# Altium schematic sheet PowerSupply_404_JustBuck.SchDoc
size C; SheetNumber: 1; SheetTotal: 1; SPICEModelCacheLMAETMOC: <root> / <DocumentId>LMAETMOC</DocumentId> / </root>
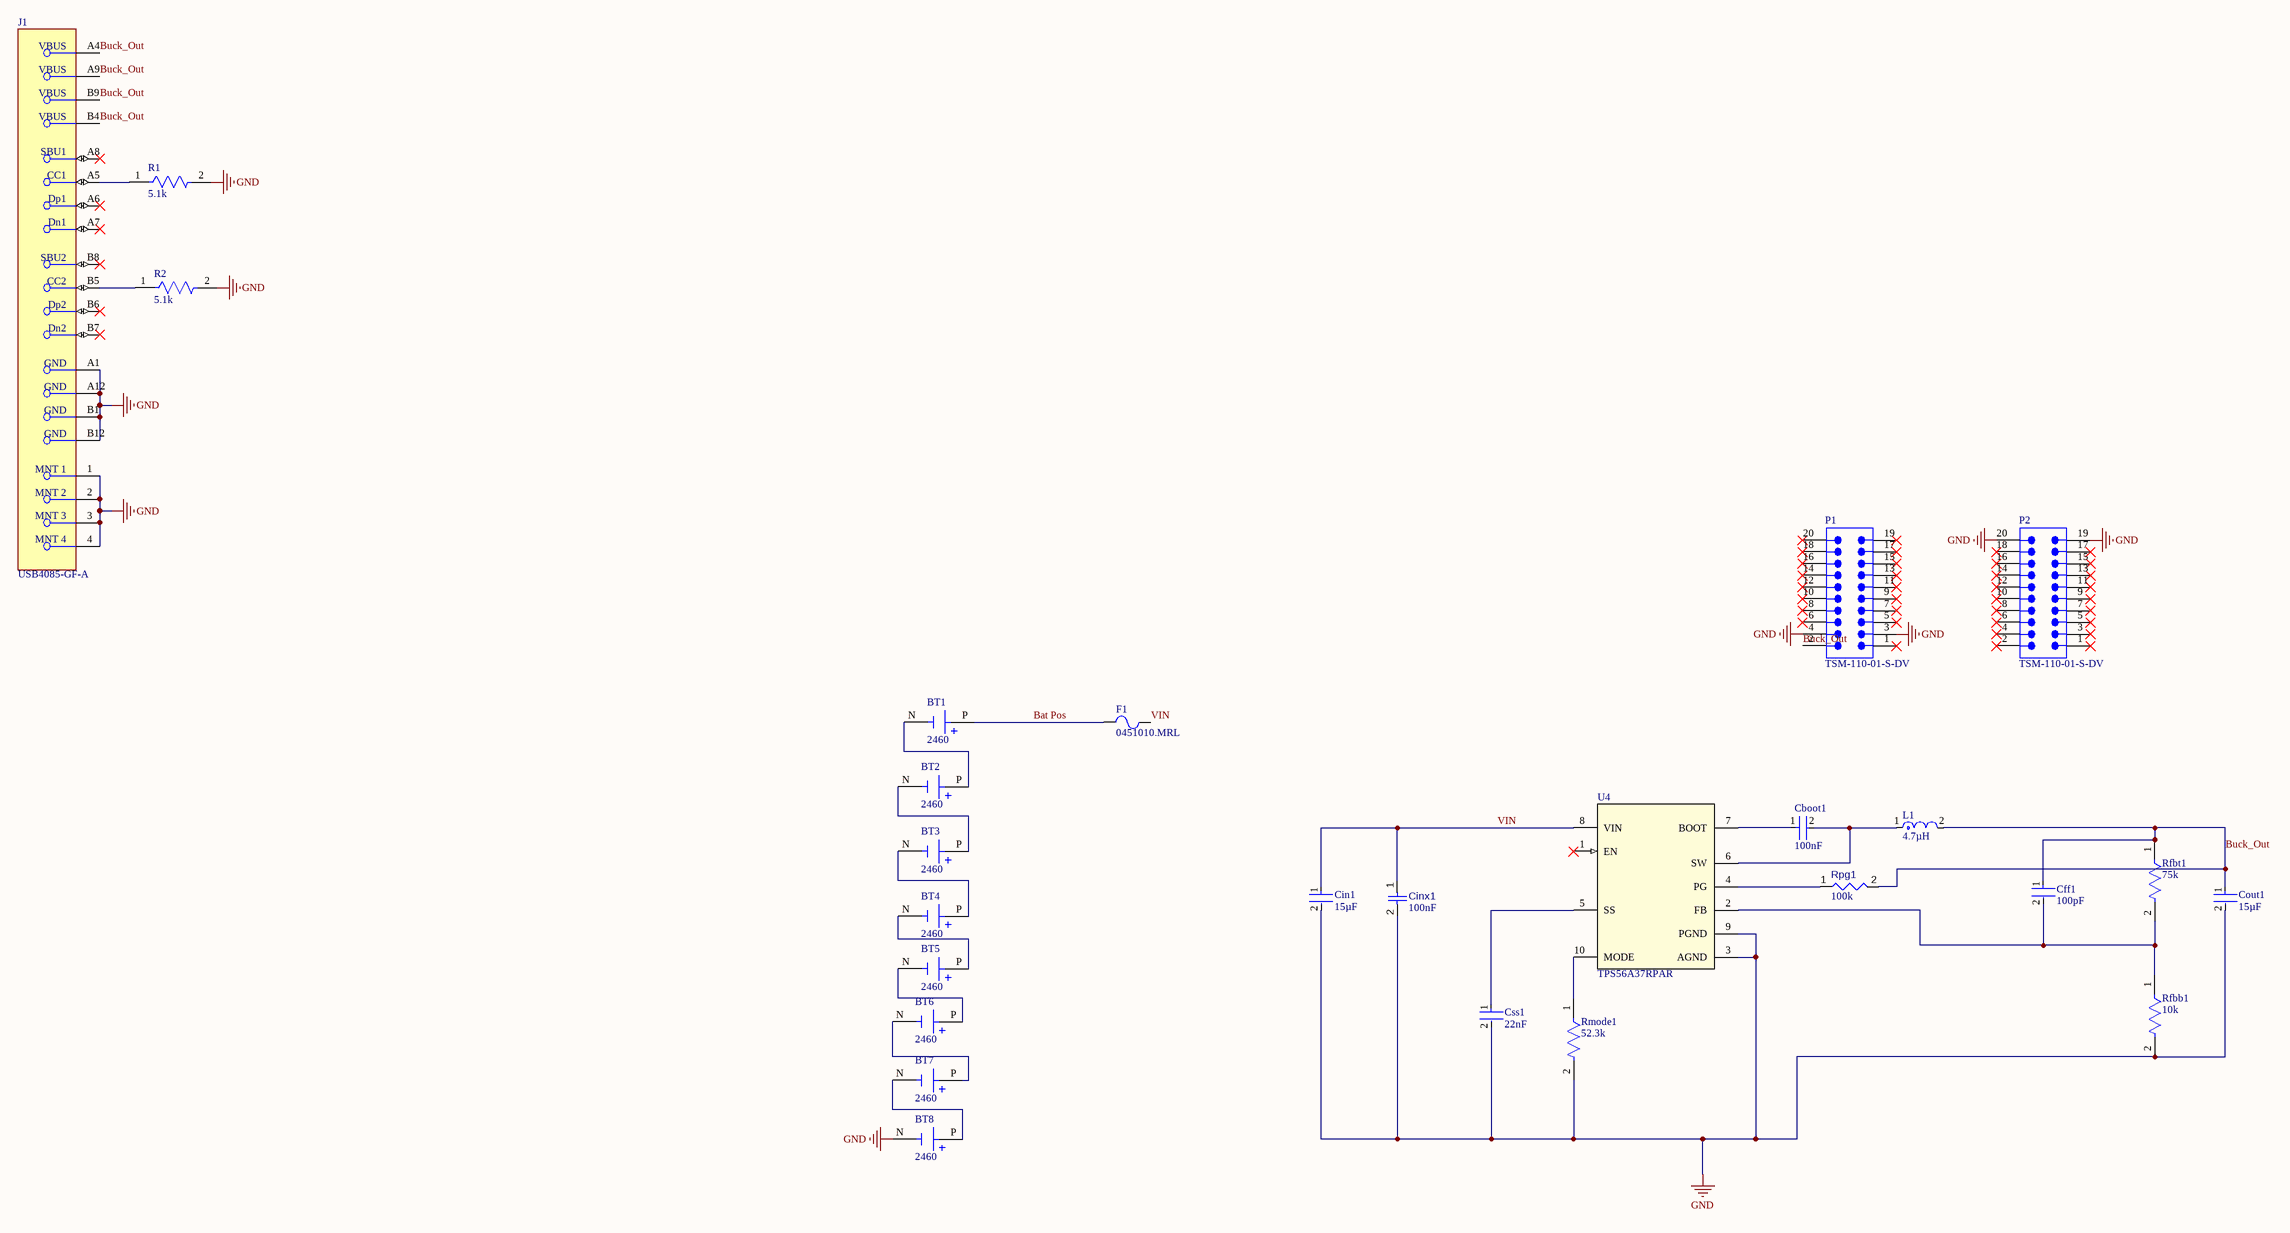
[diagram p0: PowerSupply_404_JustBuck.SchDoc]

## Parts
BT1  2460  [BAT_2460]
BT2  2460  [BAT_2460]
BT3  2460  [BAT_2460]
BT4  2460  [BAT_2460]
BT5  2460  [BAT_2460]
BT6  2460  [BAT_2460]
BT7  2460  [BAT_2460]
BT8  2460  [BAT_2460]
Cboot1  value 100nF  [FP-C0805C-DN-IPC_A]  (hidden comment: C0805C104M5RACTU)
Cff1  value 100pF  [FP-C0805C-DN-IPC_A]  (hidden comment: C0805C101K5GACTU)
Cin1  value 15µF  [FP-C2012-125-0_2-IPC_A]  (hidden comment: C2012X5R1V156M125AC)
Cinx1  value 100nF  [CAPC2013X95X50LL10T25]  (hidden comment: CC0805KRX7R9BB104)
Cout1  value 15µF  [FP-C3225-250-0_4-IPC_A]  (hidden comment: C3225X5R1C156M250AA)
Css1  value 22nF  [FP-C0603C-CF-IPC_B]  (hidden comment: C0603C223K4RACTU)
F1  0451010.MRL  [LFUS-45X_V]
J1  USB4085-GF-A  [FP-USB4085-GF-A-MFG]
L1  value 4.7µH  [FP-XAL6060-472MEC-MFG]  (hidden comment: XAL6060-472MEC)
P1  TSM-110-01-S-DV  [SMTC-TSM-110-01-X-DV]
P2  TSM-110-01-S-DV  [SMTC-TSM-110-01-X-DV]
R1  value 5.1k  [FP-RT0603-IPC_C]  (hidden comment: RT0603FRE075K1L)
R2  value 5.1k  [FP-RT0603-IPC_C]  (hidden comment: RT0603FRE075K1L)
Rfbb1  value 10k  [FP-CRCW0805-e3-IPC_A]  (hidden comment: CRCW080510K0FKEA)
Rfbt1  value 75k  [FP-CRCW0805-e3-IPC_A]  (hidden comment: CRCW080575K0FKEA)
Rmode1  value 52.3k  [FP-CRCW0603-e3-IPC_C]  (hidden comment: CRCW060352K3FKEA)
Rpg1  value 100k  [RESC2013X70X40ML20T20]  (hidden comment: ERJ-6ENF1003V)
U4  TPS56A37RPAR  [RPA0010A-MFG]

## Nets
GND: BT8.N(NEG) Cin1.2 Cinx1.2 Cout1.2 Css1.2 J1.1(MNT_1) J1.2(MNT_2) J1.3(MNT_3) J1.4(MNT_4) J1.A1(GND) J1.A12(GND) J1.B1(GND) J1.B12(GND) P1.3 P1.4 P2.19 P2.20 R1.2 R2.2 Rfbb1.2 Rmode1.2 U4.3(AGND) U4.9(PGND)
Bat Pos: BT1.P(POS) F1.1
Buck_Out: Cff1.1 Cout1.1 J1.A4(VBUS) J1.A9(VBUS) J1.B4(VBUS) J1.B9(VBUS) L1.2 P1.2 Rfbt1.1 Rpg1.2
VIN: Cin1.1 Cinx1.1 F1.2 U4.8(VIN)
NetBT1_N: BT1.N(NEG) BT2.P(POS)
NetBT2_N: BT2.N(NEG) BT3.P(POS)
NetBT3_N: BT3.N(NEG) BT4.P(POS)
NetBT4_N: BT4.N(NEG) BT5.P(POS)
NetBT5_N: BT5.N(NEG) BT6.P(POS)
NetBT6_N: BT6.N(NEG) BT7.P(POS)
NetBT7_N: BT7.N(NEG) BT8.P(POS)
NetCboot1_1: Cboot1.1 U4.7(BOOT)
NetCboot1_2: Cboot1.2 L1.1 U4.6(SW)
NetCff1_2: Cff1.2 Rfbb1.1 Rfbt1.2 U4.2(FB)
NetCss1_1: Css1.1 U4.5(SS)
NetJ1_A5: J1.A5(CC1) R1.1
NetJ1_B5: J1.B5(CC2) R2.1
NetRmode1_1: Rmode1.1 U4.10(MODE)
NetRpg1_1: Rpg1.1 U4.4(PG)

Not connected (* = marked no-connect by the designer): J1 A6(Dp1)* A7(Dn1)* A8(SBU1)* B6(Dp2)* B7(Dn2)* B8(SBU2)*; P1 1* 5* 6* 7* 8* 9* 10* 11* 12* 13* 14* 15* 16* 17* 18* 19* 20*; P2 1* 2* 3* 4* 5* 6* 7* 8* 9* 10* 11* 12* 13* 14* 15* 16* 17* 18*; U4 1(EN)*

## Library data of the parts
BT1-BT8 = CMP-00029-00003-2: Battery Holder, AA, Polypropylene, PC Mount, 1, Spring, PC Lug; MF: Keystone Electronics; Value: *; SnapEDA_Link: https://www.snapeda.com/parts/2460/Keystone/view-part/?ref=snap; Case/Package: None; MP: 2460; Check_prices: https://www.snapeda.com/parts/2460/Keystone/view-part/?ref=eda; Design Item ID: 2460; Component Type: Standard; Source: 2460.SchLib; Pins: 2
Cboot1 = CMP-001-00110-1: 50V 100nF X7R ±20% 0805 Multilayer Ceramic Capacitors MLCC - SMD/SMT ROHS; Dissipation Factor: 2.5%; Temperature Coefficient: 30ppm/°C; Case Code (Imperial): 0805; Introduction Date: 2008-01-10; Depth: 1.25mm; Number of Terminals: 2; Voltage: 50V; Harmonized Tariff Schedule (HTS) Code: 8532.24.00.20; Width: 1.25mm; Export Control Classification Number (ECCN) Code: EAR99; China RoHS: Compliant; Thickness: 889µm; Tolerance: 20%; Schedule B: 8532240020, 8532240020; Voltage Rating: 50V; RoHS: Compliant; Termination: SMD/SMT; Country of Origin: Mexico; Lifecycle Status: Production; Lead Free: Lead Free; Packaging: Cut Tape; Weight: 5.499807mg; Max Operating Temperature: 125°C; Pins: 2; Case/Package: 0805; Height: 780µm; Voltage Rating (DC): 50V; Length: 2mm; Min Operating Temperature: -55°C; REACH SVHC: Yes; Dielectric: X7R; Dielectric Material: Ceramic; Material: Ceramic; Mounting Technology: Surface Mount; Radiation Hardening: No
Cff1 = CMP-001-00093-1: 50V 100pF C0G ±10% 0805 Multilayer Ceramic Capacitors MLCC - SMD/SMT ROHS; Temperature Coefficient: 30ppm/°C; Dissipation Factor: 0.1%; RoHS: Compliant; Dielectric Material: Ceramic; Material: Ceramic; Depth: 1.25mm; Lead Pitch: 750µm; Mounting Technology: Surface Mount; Voltage Rating (DC): 50V; Voltage Rating: 50V; Lead Free: Lead Free; Termination: SMD/SMT; Number of Terminals: 2; Lifecycle Status: Production; Width: 1.25mm; Case Code (Imperial): 0805; Length: 2mm; Export Control Classification Number (ECCN) Code: EAR99; Tolerance: 10%; Country of Origin: Mexico; Radiation Hardening: No; REACH SVHC: Yes; Min Operating Temperature: -55°C; Max Operating Temperature: 125°C; Harmonized Tariff Schedule (HTS) Code: 8532.24.00.20; China RoHS: Compliant; Pins: 2; Packaging: Cut Tape; Case/Package: 0805; Height: 780µm; Introduction Date: 2008-01-10; Schedule B: 8532240020, 8532240020; Thickness: 889µm; Voltage: 50V; Dielectric: C0G; Contact Plating: Tin
Cin1 = CMP-001-00107-1: 35V 15uF X5R 卤20% 0805 Multilayer Ceramic Capacitors MLCC - SMD/SMT ROHS; Manufacturer Lifecycle Status: PRODUCTION; Tolerance: 20%; Voltage Rating: 35V; Dielectric Material: Ceramic; Width: 1.25mm; Case Code (Metric): 2012; Export Control Classification Number (ECCN) Code: EAR99; Max Operating Temperature: 85°C; Schedule B: 8532240020, 8532240020; Lifecycle Status: Production; Case Code (Imperial): 0805; Introduction Date: 2013-02-27; Dielectric: X5R; REACH SVHC: Yes; Material: Ceramic; Composition: Ceramic; Packaging: Digi-Reel®; Termination: SMD/SMT; Min Length: 1.8mm; Number of Terminals: 2; Harmonized Tariff Schedule (HTS) Code: 8532.24.00.20; Min Operating Temperature: -55°C; Min Width: 1.05mm; Lead Free: Lead Free; China RoHS: Compliant; RoHS: Compliant; Length: 2mm; Max Width: 1.45mm; Case/Package: 0805; Mounting Technology: Surface Mount; Voltage Rating (DC): 35V; Height: 1.25mm; Max Length: 2.2mm
Cinx1 = CMP-001-00018-6: Chip Capacitor, 100 nF, +/- 10%, 50 V, 0805 (2012 Metric); Capacitor Type: Ceramic; Voltage Rating: 50V; Pins: 2; Max Operating Temperature: 125°C; Min Operating Temperature: -55°C; Mounting Technology: SM; Case/Package: 0805; RoHS Compliant: True; Tolerance: 10%
Cout1 = CMP-001-00109-1: 16V 15uF X5R 卤20% 1210 Multilayer Ceramic Capacitors MLCC - SMD/SMT ROHS; Manufacturer Lifecycle Status: PRODUCTION (NOT RECOMMENDED FOR NEW DESIGN); Tolerance: 20%; Schedule B: 8532240020, 8532240020; Termination: SMD/SMT; Width: 2.5mm; Dielectric Material: Ceramic; Max Operating Temperature: 85°C; Harmonized Tariff Schedule (HTS) Code: 8532.24.00.20; Export Control Classification Number (ECCN) Code: EAR99; Case Code (Imperial): 1210; Length: 3.2mm; Lead Free: Lead Free; Packaging: Digi-Reel®; REACH SVHC: Yes; Min Operating Temperature: -55°C; China RoHS: Compliant; Min Width: 2.2mm; Min Length: 2.8mm; Case/Package: 1210; Mounting Technology: Surface Mount; Max Width: 2.8mm; Case Code (Metric): 3225; Number of Terminals: 2; Dielectric: X5R; RoHS: Compliant; Voltage Rating: 16V; Material: Ceramic; Introduction Date: 2012-08-21; Lifecycle Status: NRND; Height: 2.5mm; Voltage Rating (DC): 16V; Composition: Ceramic; Depth: 2.5mm; Max Length: 3.6mm; Weight: 15.989131mg
Css1 = CMP-001-00108-1: Multilayer Ceramic Capacitors MLCC - SMD/SMT 16V 0.022uF X7R 0603 10%; Temperature Coefficient: 30ppm/°C; Export Control Classification Number (ECCN) Code: EAR99; Min Operating Temperature: -55°C; Termination: SMD/SMT; China RoHS: Compliant; Voltage Rating (DC): 16V; Number of Terminals: 2; Introduction Date: 2001-04-27; REACH SVHC: Yes; Material: Ceramic; RoHS: Compliant; Voltage Rating: 16V; Radiation Hardening: No; Weight: 2.012816mg; Width: 800µm; Thickness: 863.6µm; Depth: 800µm; Pins: 2; Case Code (Imperial): 0603; Dielectric Material: Ceramic; Harmonized Tariff Schedule (HTS) Code: 8532.24.00.20; Case/Package: 0603; Lifecycle Status: Production; Dielectric: X7R; Tolerance: 10%; Height: 800µm; Country of Origin: Mexico; Length: 1.6mm; Schedule B: 8532240020, 8532240020; Mounting Technology: Surface Mount; Lead Free: Lead Free; Max Operating Temperature: 125°C
F1 = CMP-005-00013-1: Fuse Chip Very Fast Acting 10A 125V SMD Solder Pad 2410 Ceramic T/R CSA/PSE/UL; Time to Trip: 5s; Value: 5.6mΩ; Approvals: CSA, PSE, UL; Height: 2.69mm; Working Voltage: 125V; Lead Free: Lead Free; RoHS: Compliant; Mounting Technology: Surface Mount; Voltage Rating (DC): 125V; Depth: 2.69mm; Case/Package: SMD/SMT; Length: 6.1mm; Export Control Classification Number (ECCN) Code: EAR99; Country of Origin: Philippines; Fuse Current: 10A; Min Operating Temperature: -55°C; Pins: 2; Contact Plating: Gold; Current Rating: 10A; Diameter: 2.69mm; Width: 2.69mm; Lifecycle Status: Production; Voltage Rating: 125V; Termination: SMD/SMT; REACH SVHC: No; China RoHS: Non-Compliant; Radiation Hardening: No; Introduction Date: 2008-03-05; Terminal Material: Gold; Housing Material: Ceramic; Harmonized Tariff Schedule (HTS) Code: 8536.10.00.40; Max Operating Temperature: 125°C; Body Material: Ceramic; Voltage Rating (AC): 125V
J1 = CMP-002-00075-1: USB Connector, 16 Contact(s), Female, Right Angle, Solder Terminal, Locking, Receptacle; Voltage Rating: 20V; Insulation Resistance: 100MΩ; USB Standard: USB 2.0; Row Spacing: 1.35mm; Contact Resistance: 50mΩ; Dielectric Material: Liquid Crystal Polymer; Number of Ports: 1; Operating Force: 20N; Current Rating: 250mA; Number of Contacts: 16; Pins: 16; Country of Origin: Mainland China; Terminal Pitch: 850µm; Contact Gender: Female; REACH SVHC: Yes; Contact Material: Gold, Nickel; Height: 3.66mm; Introduction Date: 2018-08-17; China RoHS: Compliant; Shell Finish: Nickel; Max Operating Temperature: 85°C; Harmonized Tariff Schedule (HTS) Code: 8536.69.40.30; Shell Material: Stainless Steel; Lifecycle Status: Production; Number of Rows: 2; RoHS: Compliant; Gender: Receptacle; Export Control Classification Number (ECCN) Code: EAR99; Min Operating Temperature: -40°C
L1 = CMP-006-00027-1: XAL6060-472MEC; General Purpose Inductor, 4.7uH, 20%, 1 Element, Composite-Core, SMD, 2625; Max Current Rating: 11A; Self Resonant Frequency: 21MHz; Test Frequency: 1MHz; Number of Circuits: 1; DC Resistance (DCR): 14.4mΩ; Saturation Current: 10.5A; Shielding: Shielded; REACH SVHC: Yes; Inductance Tolerance: 20%; Termination: SMD/SMT; Packaging: Cut Tape; RoHS: Compliant; Lifecycle Status: Production; Height: 6.1mm; Mounting Technology: Surface Mount; Number of Terminals: 2; Ambient Temperature Range High: 125°C; Lead Free: Contains Lead; Core Material: Composite; RMS Current (Irms): 11A; Max DC Current: 11A; Length: 6.76mm; Tolerance: 20%; ESR: 14.4mΩ; Max Operating Temperature: 125°C; Min Operating Temperature: -40°C; Case/Package: SMD/SMT; Width: 6.36mm
P1 P2 = CMP-002-00074-1: 0.025" SQ Post Header, Surface Mount, Vertical, -55 to 125 degC, 2.54 mm Pitch, 20-Pin, Male, RoHS; Manufacturer: Samtec; Pitch: 2.54 mm; Component Type: Standard; PartNumber: TSM-110-01-S-DV; PackageReference: TSM-110-01-X-DV; DatasheetVersion: F-214; ComponentLink1Description: Manufacturer URL; ComponentLink3URL: http://www.samtec.com/documents/webfiles/cpdf/TSM-1XX-XX-XXX-XX-X-XXX-X-MKT.pdf; Source: TSM_110_01_S_DV.SchLib; ComponentLink1URL: http://www.samtec.com; Design Item ID: CMP-1024-00283-1; ComponentLink2Description: Datasheet; PackageVersion: DJ, 4/1991; Mounting Technology: Surface Mount; Orientation: Vertical; Pins: 20; Temperature Range: -55 to 125 degC; ComponentLink3Description: Package Specification; ComponentLink2URL: http://www.samtec.com/documents/webfiles/pdf/TSM.PDF; Case/Package: Double Row Gullwing ASM; RoHS: True
R1 R2 = CMP-009-00180-1: Fixed Resistor, Thin Film, 0.1W, 5100ohm, 75V, 1% +/-Tol, 50ppm/Cel, Surface Mount, 0603; Power Dissipation: 100mW; Voltage Rating (DC): 50V; Temperature Coefficient: 50ppm/°C; Voltage Rating: 75V; Number of Terminals: 2; Lead Free: Lead Free; Width: 800µm; Working Voltage: 75V; Lifecycle Status: Production; Height: 450µm; RoHS: Compliant; Power Rating: 100mW; Mounting Technology: Surface Mount; Length: 1.6mm; China RoHS: Non-Compliant; Max Power Dissipation: 100mW; Number of Terminations: 2; Termination: SMD/SMT; Case/Package: 0603; REACH SVHC: Yes; Max Operating Temperature: 155°C; Tolerance: 1%; Military Standard: Not; Min Operating Temperature: -55°C; Composition: Thin Film; Depth: 800µm; Case Code (Imperial): 0603
Rfbb1 = CMP-009-00183-1: Res Thick Film 0805 10K Ohm 1% 0.125W(1/8W) ±100ppm/C Pad SMD Automotive T/R; Manufacturer Package Identifier: CRCW0805-e3; Temperature Coefficient: 100ppm/°C; Voltage Rating: 150V; Power Dissipation: 125mW; Power Rating: 120mW; Country of Origin: Israel; Weight: 5.499807mg; Radiation Hardening: No; Height: 450µm; Length: 2mm; Tolerance: 1%; Width: 1.25mm; Harmonized Tariff Schedule (HTS) Code: 8533.21.00.30; Working Voltage: 150V; Packaging: Cut Tape; Military Standard: Not; Max Operating Temperature: 155°C; Min Operating Temperature: -55°C; Lifecycle Status: Production; Case/Package: 0805; Depth: 1.25mm; Contact Plating: Tin; Export Control Classification Number (ECCN) Code: EAR99; Lead Free: Lead Free; Schedule B: 8533210045, 8533210045; Composition: Thick Film; RoHS: Compliant; Mounting Technology: Surface Mount; Voltage Rating (DC): 150V; Number of Terminals: 2; Introduction Date: 2005-02-16; Pins: 2; Termination: SMD/SMT; Case Code (Imperial): 0805; REACH SVHC: Yes; China RoHS: Non-Compliant
Rfbt1 = CMP-009-00196-1: Res Thick Film 0805 75K Ohm 1% 1/8W ±100ppm/°C Molded SMD Paper T/R; Manufacturer Package Identifier: CRCW0805-e3; Working Voltage: 150V; Power Dissipation: 125mW; Number of Terminals: 2; Weight: 5.499807mg; Temperature Coefficient: 100ppm/°C; Schedule B: 8533210045, 8533210045; Min Operating Temperature: -55°C; Pins: 2; Mounting Technology: Surface Mount; Termination: SMD/SMT; Voltage Rating: 150V; China RoHS: Non-Compliant; Max Operating Temperature: 155°C; Voltage Rating (DC): 150V; Number of Terminations: 2; Width: 1.25mm; Height: 450µm; Depth: 1.25mm; Max Power Dissipation: 125mW; Radiation Hardening: No; Introduction Date: 2005-02-16; Case Code (Imperial): 0805; Features: Automotive AEC-Q200; Harmonized Tariff Schedule (HTS) Code: 8533.21.00.30; Length: 2mm; Country of Origin: Israel; Contact Plating: Tin; Lifecycle Status: Production; Composition: Thick Film; Export Control Classification Number (ECCN) Code: EAR99; Military Standard: Not; REACH SVHC: Yes; RoHS: Compliant; Lead Free: Lead Free; Case/Package: 0805; Power Rating: 125mW; Packaging: Cut Tape; Tolerance: 1%
Rmode1 = CMP-009-00197-1: 100mW Thick Film Resistors 75V ±1% ±100ppm/℃ 52.3kΩ 0603 Chip Resistor - Surface Mount ROHS; Temperature Coefficient: 100ppm/°C; Country of Origin: Israel, Taiwan; Width: 850µm; Schedule B: 8533210045, 8533210045; Power Dissipation: 100mW; Power Rating: 100mW; Voltage Rating: 75V; Max Operating Temperature: 155°C; Contact Plating: Tin; Lead Free: Lead Free; Composition: Thick Film; Harmonized Tariff Schedule (HTS) Code: 8533.21.00.30; Packaging: Cut Tape; Length: 1.55mm; Max Power Dissipation: 100mW; Export Control Classification Number (ECCN) Code: EAR99; Weight: 2.012816mg; Lifecycle Status: Production; Number of Terminals: 2; Features: Automotive AEC-Q200; Working Voltage: 75V; Military Standard: Not; RoHS: Compliant; Min Operating Temperature: -55°C; Radiation Hardening: No; Height: 450µm; Depth: 850µm; China RoHS: Non-Compliant; Tolerance: 1%; Mounting Technology: Surface Mount; Introduction Date: 2005-02-16; Termination: SMD/SMT; REACH SVHC: Yes; Case Code (Imperial): 0603; Number of Terminations: 2; Case/Package: 0603; Pins: 2
Rpg1 = CMP-009-00024-5: Chip Resistor, 100 KOhm, +/- 1%, 0.125 W, -55 to 155 degC, 0805 (2012 Metric); Power: 125mW; Voltage Rating: 150V; Max Operating Temperature: 155°C; Mounting Technology: SM; RoHS Compliant: True; Tolerance: 1%; Case/Package: 0805; Min Operating Temperature: -55°C; Pins: 2
U4 = CMP-044-000000-1: 4.5V to 28V input, 10A synchronous buck converter 10-VQFN-HR -40 to 150; Manufacturer_Name: Texas Instruments; RefDes: RefDes; Manufacturer_Part_Number: TPS56A37RPAR; Pin Count: 10; Source: TPS56A37RPAR.SchLib; Component Type: Standard; Design Item ID: TPS56A37RPAR; Copyright: Copyright (C) 2025 Ultra Librarian. All rights reserved.; TYPE: TYPE